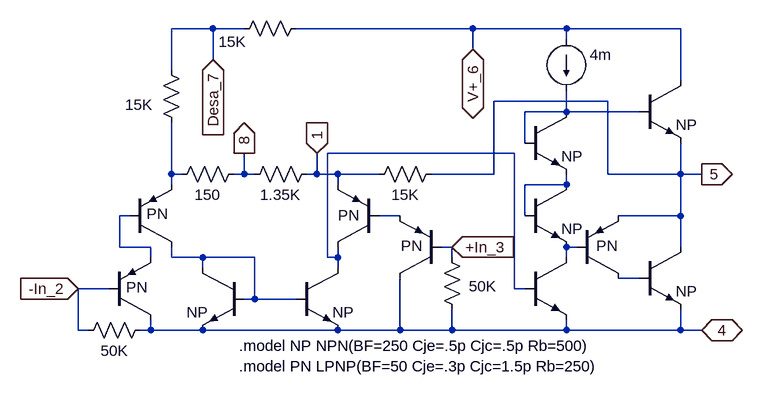
[diagram p0: schematic lm386.asc]
lm386.asc, the LTspice schematic file:
Version 4
SHEET 1 880 680
WIRE -256 -32 -320 -32
WIRE -208 -32 -256 -32
WIRE 144 -32 -128 -32
WIRE 288 -32 144 -32
WIRE 464 -32 288 -32
WIRE 288 -16 288 -32
WIRE 144 0 144 -32
WIRE -256 16 -256 -32
WIRE -320 32 -320 -32
WIRE 464 48 464 -32
WIRE 352 80 176 80
WIRE 288 96 288 64
WIRE 288 96 224 96
WIRE 400 96 288 96
WIRE 224 144 224 96
WIRE 208 160 -80 160
WIRE -320 192 -320 112
WIRE -304 192 -320 192
WIRE -208 192 -208 160
WIRE -208 192 -224 192
WIRE -192 192 -208 192
WIRE -96 192 -96 160
WIRE -96 192 -112 192
WIRE -64 192 -96 192
WIRE 0 192 -64 192
WIRE 176 192 176 80
WIRE 176 192 80 192
WIRE 352 192 352 80
WIRE 464 192 464 144
WIRE 464 192 352 192
WIRE 496 192 464 192
WIRE -320 208 -320 192
WIRE -64 208 -64 192
WIRE 288 208 288 192
WIRE 288 208 224 208
WIRE -384 256 -400 256
WIRE 32 256 0 256
WIRE 224 256 224 208
WIRE 464 256 464 192
WIRE 464 256 368 256
WIRE -400 304 -400 256
WIRE -352 304 -400 304
WIRE 112 304 96 304
WIRE 304 304 288 304
WIRE 464 304 464 256
WIRE -352 320 -352 304
WIRE -320 320 -320 304
WIRE -272 320 -320 320
WIRE -192 320 -272 320
WIRE -80 320 -80 160
WIRE -64 320 -64 304
WIRE -64 320 -80 320
WIRE 112 320 112 304
WIRE 288 320 288 304
WIRE -272 336 -272 320
WIRE -64 336 -64 320
WIRE 400 352 368 352
WIRE -416 368 -464 368
WIRE 208 368 208 160
WIRE 224 368 208 368
WIRE -192 384 -192 320
WIRE -192 384 -208 384
WIRE -128 384 -192 384
WIRE -464 432 -464 368
WIRE -448 432 -464 432
WIRE -352 432 -352 416
WIRE -352 432 -368 432
WIRE -272 432 -352 432
WIRE -64 432 -272 432
WIRE 32 432 32 352
WIRE 32 432 -64 432
WIRE 112 432 112 400
WIRE 112 432 32 432
WIRE 288 432 288 416
WIRE 288 432 112 432
WIRE 464 432 464 400
WIRE 464 432 288 432
WIRE 496 432 464 432
FLAG -464 368 -In_2
IOPIN -464 368 In
FLAG 112 304 +In_3
IOPIN 112 304 In
FLAG 496 432 4
IOPIN 496 432 BiDir
FLAG -96 160 1
IOPIN -96 160 In
FLAG -208 160 8
IOPIN -208 160 Out
FLAG 144 0 V+_6
IOPIN 144 0 BiDir
FLAG -256 16 Desa_7
IOPIN -256 16 In
FLAG 496 192 5
IOPIN 496 192 Out
SYMBOL npn3 -208 336 M0
WINDOW 0 56 32 Invisible 0
SYMATTR InstName Q1
SYMATTR Value NP
SYMBOL npn3 -128 336 R0
WINDOW 0 28 50 Invisible 0
SYMATTR InstName Q2
SYMATTR Value NP
SYMBOL pnp2 -416 416 M180
WINDOW 3 26 50 Left 0
WINDOW 0 84 32 Invisible 0
SYMATTR Value PN
SYMATTR InstName Q6
SYMBOL pnp2 0 304 R180
WINDOW 0 36 44 Invisible 0
WINDOW 3 31 49 Left 0
SYMATTR InstName Q7
SYMATTR Value PN
SYMBOL pnp2 96 352 R180
WINDOW 0 25 43 Invisible 0
WINDOW 3 30 50 Left 0
SYMATTR InstName Q8
SYMATTR Value PN
SYMBOL pnp2 -384 304 M180
WINDOW 3 26 51 Left 0
WINDOW 0 84 32 Invisible 0
SYMATTR Value PN
SYMATTR InstName Q10
SYMBOL current 288 -16 R0
WINDOW 0 24 0 Invisible 0
WINDOW 3 36 24 Left 0
SYMATTR InstName I1
SYMATTR Value 4m
SYMBOL res 96 304 R0
WINDOW 0 36 40 Invisible 0
WINDOW 3 42 60 Left 0
SYMATTR InstName R1
SYMATTR Value 50K
SYMATTR SpiceLine tol=1 pwr=0.1
SYMBOL res 96 176 R90
WINDOW 0 0 56 Invisible 0
WINDOW 3 32 56 VTop 0
SYMATTR InstName R2
SYMATTR Value 15K
SYMATTR SpiceLine tol=1 pwr=0.1
SYMBOL res -96 176 R90
WINDOW 0 0 56 Invisible 0
WINDOW 3 32 56 VTop 0
SYMATTR InstName R3
SYMATTR Value 1.35K
SYMATTR SpiceLine tol=1 pwr=0.1
SYMBOL res -208 176 R90
WINDOW 0 0 56 Invisible 0
WINDOW 3 32 56 VTop 0
SYMATTR InstName R4
SYMATTR Value 150
SYMATTR SpiceLine tol=1 pwr=0.1
SYMBOL res -336 16 R0
WINDOW 0 36 40 Invisible 0
WINDOW 3 -55 69 Left 0
SYMATTR InstName R5
SYMATTR Value 15K
SYMATTR SpiceLine tol=1 pwr=0.1
SYMBOL res -112 -48 R90
WINDOW 0 0 56 Invisible 0
WINDOW 3 21 114 VTop 0
SYMATTR InstName R6
SYMATTR Value 15K
SYMATTR SpiceLine tol=1 pwr=0.1
SYMBOL res -352 416 R90
WINDOW 0 0 56 Invisible 0
WINDOW 3 32 56 VTop 0
SYMATTR InstName R7
SYMATTR Value 50K
SYMATTR SpiceLine tol=1 pwr=0.1
SYMBOL npn3 224 320 R0
WINDOW 0 28 50 Invisible 0
WINDOW 3 56 68 Invisible 0
SYMATTR InstName Q3
SYMATTR Value 2N2222
SYMBOL pnp2 304 352 M180
WINDOW 0 25 43 Invisible 0
WINDOW 3 30 50 Left 0
SYMATTR InstName Q9
SYMATTR Value PN
SYMBOL npn3 400 304 R0
WINDOW 0 28 50 Invisible 0
SYMATTR InstName Q5
SYMATTR Value NP
SYMBOL npn3 400 48 R0
WINDOW 0 28 50 Invisible 0
SYMATTR InstName Q4
SYMATTR Value NP
SYMBOL npn3 224 96 R0
WINDOW 0 28 50 Invisible 0
SYMATTR InstName Q11
SYMATTR Value NP
SYMBOL npn3 224 208 R0
WINDOW 0 28 50 Invisible 0
SYMATTR InstName Q12
SYMATTR Value NP
TEXT -216 456 Left 0 !.model NP NPN(BF=250 Cje=.5p Cjc=.5p Rb=500)\n.model PN LPNP(BF=50 Cje=.3p Cjc=1.5p Rb=250)

The netlist it stands for:
* lm386.asc
Q1 N008 N008 4 0 NP
Q2 N002 N008 4 0 NP
Q6 4 -In_2 N005 0 PN
Q7 N002 N006 1 0 PN
Q8 4 +In_3 N006 0 PN
Q10 N008 N005 N003 0 PN
I1 V+_6 N001 4m
R1 +In_3 4 50K tol=1 pwr=0.1
R2 5 1 15K tol=1 pwr=0.1
R3 1 8 1.35K tol=1 pwr=0.1
R4 8 N003 150 tol=1 pwr=0.1
R5 Desa_7 N003 15K tol=1 pwr=0.1
R6 V+_6 Desa_7 15K tol=1 pwr=0.1
R7 4 -In_2 50K tol=1 pwr=0.1
Q3 N007 N002 4 0 2N2222
Q9 N009 N007 5 0 PN
Q5 5 N009 4 0 NP
Q4 V+_6 N001 5 0 NP
Q11 N001 N001 N004 0 NP
Q12 N004 N004 N007 0 NP
.model NPN NPN
.model PNP PNP
.lib standard.bjt
.model NP NPN(BF=250 Cje=.5p Cjc=.5p Rb=500)
.model PN LPNP(BF=50 Cje=.3p Cjc=1.5p Rb=250)
.backanno
.end